# Altium project Drivers.PrjPcb
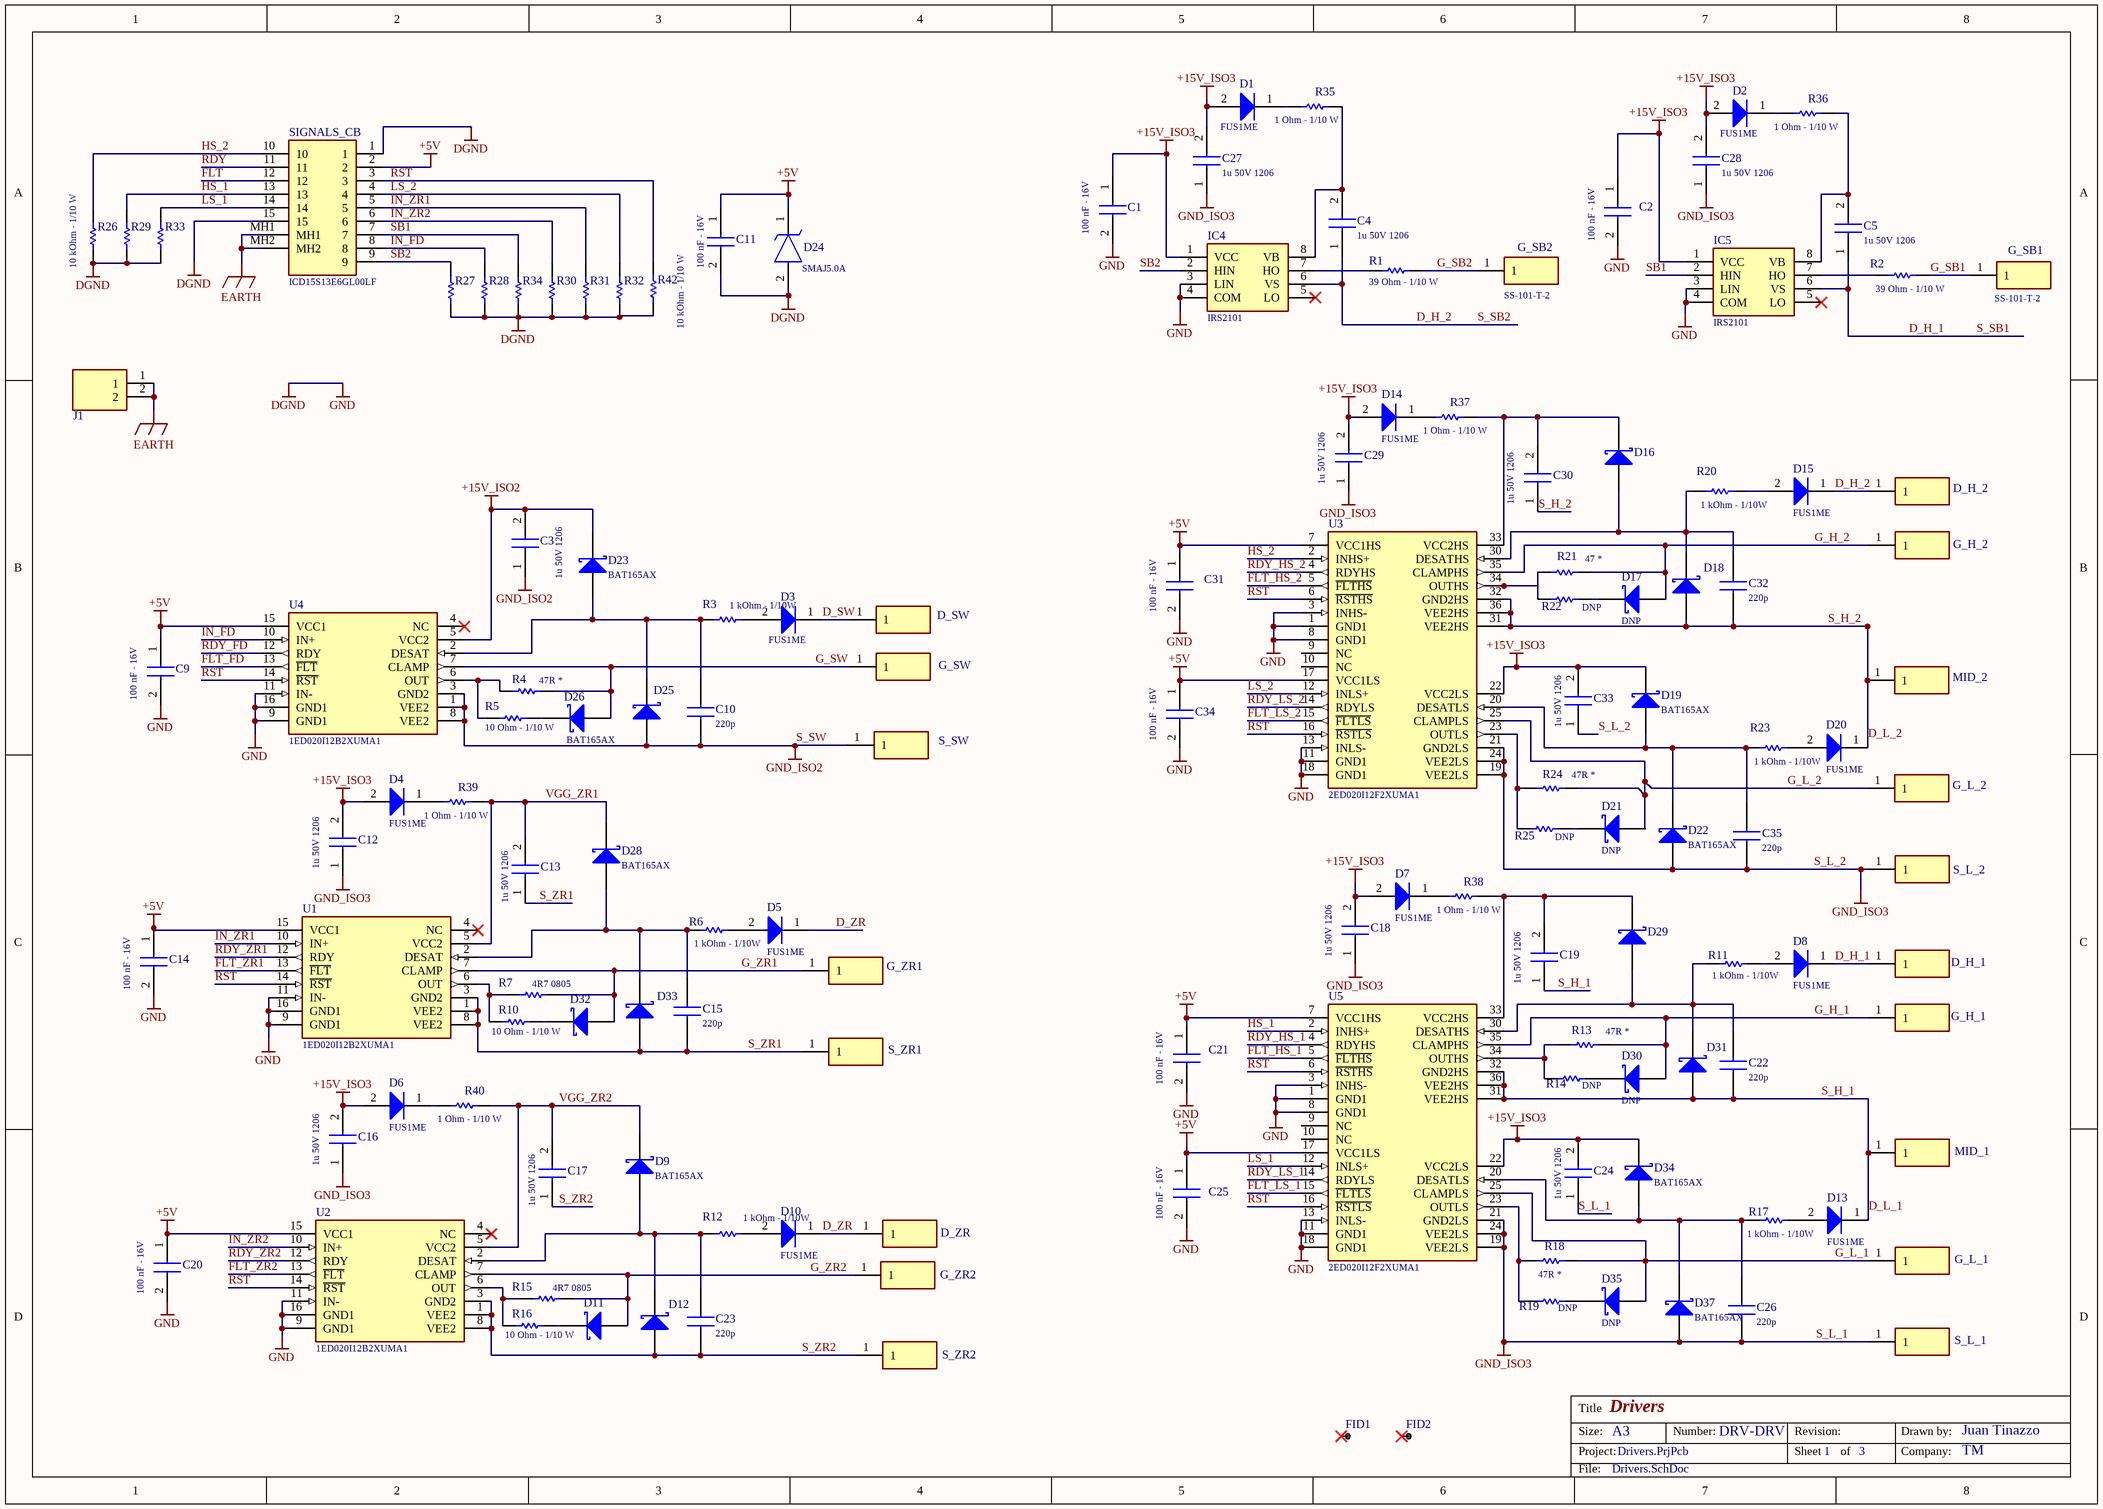
[diagram p0: Drivers.SchDoc]
REV: R8
3 sheets, 168 parts. Net scope: global (net labels, ports and power ports of the same name join across sheets).
Board file: Drivers.PcbDoc
Sheets:
  Drivers.SchDoc
  Gates.SchDoc
  Power.SchDoc

## Sheet Drivers.SchDoc: Drivers
size A3; SheetNumber: 1; SheetTotal: 3; DrawnBy: Juan Tinazzo; Organization: PAI; DocumentNumber: 1; Revision: R8; Number: DRV-DRV; Company: TM

### Parts
C1  value 100 nF - 16V  [CAPC1608X95N]  (hidden comment: 100n)
C2  value 100 nF - 16V  [CAPC1608X95N]  (hidden comment: 100n)
C3  1u 50V 1206  [CAPC3216X180N]
C4  1u 50V 1206  [CAPC3216X180N]
C5  1u 50V 1206  [CAPC3216X180N]
C9  value 100 nF - 16V  [CAPC1608X95N]  (hidden comment: 100n)
C10  220p  [C0603]
C11  value 100 nF - 16V  [CAPC1608X95N]  (hidden comment: 100n)
C12  1u 50V 1206  [CAPC3216X180N]
C13  1u 50V 1206  [CAPC3216X180N]
C14  value 100 nF - 16V  [CAPC1608X95N]  (hidden comment: 100n)
C15  220p  [C0603]
C16  1u 50V 1206  [CAPC3216X180N]
C17  1u 50V 1206  [CAPC3216X180N]
C18  1u 50V 1206  [CAPC3216X180N]
C19  1u 50V 1206  [CAPC3216X180N]
C20  value 100 nF - 16V  [CAPC1608X95N]  (hidden comment: 100n)
C21  value 100 nF - 16V  [CAPC1608X95N]  (hidden comment: 100n)
C22  220p  [C0603]
C23  220p  [C0603]
C24  1u 50V 1206  [CAPC3216X180N]
C25  value 100 nF - 16V  [CAPC1608X95N]  (hidden comment: 100n)
C26  220p  [C0603]
C27  1u 50V 1206  [CAPC3216X180N]
C28  1u 50V 1206  [CAPC3216X180N]
C29  1u 50V 1206  [CAPC3216X180N]
C30  1u 50V 1206  [CAPC3216X180N]
C31  value 100 nF - 16V  [CAPC1608X95N]  (hidden comment: 100n)
C32  220p  [C0603]
C33  1u 50V 1206  [CAPC3216X180N]
C34  value 100 nF - 16V  [CAPC1608X95N]  (hidden comment: 100n)
C35  220p  [C0603]
D1  FUS1ME  [SODFL3718X120N]
D2  FUS1ME  [SODFL3718X120N]
D3  FUS1ME  [SODFL3718X120N]
D4  FUS1ME  [SODFL3718X120N]
D5  FUS1ME  [SODFL3718X120N]
D6  FUS1ME  [SODFL3718X120N]
D7  FUS1ME  [SODFL3718X120N]
D8  FUS1ME  [SODFL3718X120N]
D9  BAT165AX  [BAT165AX]
D10  FUS1ME  [SODFL3718X120N]
D11  BAT165AX  [BAT165AX]  (value not drawn)
D12  BAT165AX  [BAT165AX]  (value not drawn)
D13  FUS1ME  [SODFL3718X120N]
D14  FUS1ME  [SODFL3718X120N]
D15  FUS1ME  [SODFL3718X120N]
D16  BAT165AX  [BAT165AX]  (value not drawn)
D17  DNP  [BAT165AX]
D18  BAT165AX  [BAT165AX]  (value not drawn)
D19  BAT165AX  [BAT165AX]
D20  FUS1ME  [SODFL3718X120N]
D21  DNP  [BAT165AX]
D22  BAT165AX  [BAT165AX]
D23  BAT165AX  [BAT165AX]
D24  SMAJ5.0A  [DIOM5026X229N]
D25  BAT165AX  [BAT165AX]  (value not drawn)
D26  BAT165AX  [BAT165AX]
D28  BAT165AX  [BAT165AX]
D29  BAT165AX  [BAT165AX]  (value not drawn)
D30  DNP  [BAT165AX]
D31  BAT165AX  [BAT165AX]  (value not drawn)
D32  BAT165AX  [BAT165AX]  (value not drawn)
D33  BAT165AX  [BAT165AX]  (value not drawn)
D34  BAT165AX  [BAT165AX]
D35  DNP  [BAT165AX]
D37  BAT165AX  [BAT165AX]
D_H_1  SS-101-T-2  [SS-101-XX-2]  (value not drawn)
D_H_2  SS-101-T-2  [SS-101-XX-2]  (value not drawn)
D_SW  D_SW  [SS-101-XX-2]  (value not drawn)
D_ZR  SS-101-T-2  [SS-101-XX-2]  (value not drawn)
FID1  Fiducial  [Fiducial]  (value not drawn)  (no BOM)
FID2  Fiducial  [Fiducial]  (value not drawn)  (no BOM)
G_H_1  SS-101-T-2  [SS-101-XX-2]  (value not drawn)
G_H_2  SS-101-T-2  [SS-101-XX-2]  (value not drawn)
G_L_1  SS-101-T-2  [SS-101-XX-2]  (value not drawn)
G_L_2  SS-101-T-2  [SS-101-XX-2]  (value not drawn)
G_SB1  SS-101-T-2  [SS-101-XX-2]
G_SB2  SS-101-T-2  [SS-101-XX-2]
G_SW  G_SW  [SS-101-XX-2]  (value not drawn)
G_ZR1  SS-101-T-2  [SS-101-XX-2]  (value not drawn)
G_ZR2  SS-101-T-2  [SS-101-XX-2]  (value not drawn)
IC4  IRS2101  [SOIC127P600X175-8N]
IC5  IRS2101  [SOIC127P600X175-8N]
J1  19705-4303  [197054303]  (value not drawn)
MID_1  SS-101-T-2  [SS-101-XX-2]  (value not drawn)
MID_2  SS-101-T-2  [SS-101-XX-2]  (value not drawn)
R1  value 39 Ohm - 1/10 W  [RESC1608X55N]  (hidden comment: CRCW0603150RFKEBC)
R2  value 39 Ohm - 1/10 W  [RESC1608X55N]  (hidden comment: CRCW0603150RFKEBC)
R3  value 1 kOhm - 1/10W  [RESC1608X55N]  (hidden comment: CRCW06031K00FKEAC)
R4  47R *  [RESC2012X60N]
R5  value 10 Ohm - 1/10 W  [RESC1608X50N]  (hidden comment: CRCW060310R0FKEAHP)
R6  value 1 kOhm - 1/10W  [RESC1608X55N]  (hidden comment: CRCW06031K00FKEAC)
R7  4R7 0805  [RESC2012X60N]
R10  value 10 Ohm - 1/10 W  [RESC1608X50N]  (hidden comment: CRCW060310R0FKEAHP)
R11  value 1 kOhm - 1/10W  [RESC1608X55N]  (hidden comment: CRCW06031K00FKEAC)
R12  value 1 kOhm - 1/10W  [RESC1608X55N]  (hidden comment: CRCW06031K00FKEAC)
R13  47R *  [RESC2012X60N]
R14  value DNP  [RESC1608X50N]  (hidden comment: CRCW060310R0FKEAHP)
R15  4R7 0805  [RESC2012X60N]
R16  value 10 Ohm - 1/10 W  [RESC1608X50N]  (hidden comment: CRCW060310R0FKEAHP)
R17  value 1 kOhm - 1/10W  [RESC1608X55N]  (hidden comment: CRCW06031K00FKEAC)
R18  47R *  [RESC2012X60N]
R19  value DNP  [RESC1608X50N]  (hidden comment: CRCW060310R0FKEAHP)
R20  value 1 kOhm - 1/10W  [RESC1608X55N]  (hidden comment: CRCW06031K00FKEAC)
R21  47 *  [RESC2012X60N]
R22  value DNP  [RESC1608X50N]  (hidden comment: CRCW060310R0FKEAHP)
R23  value 1 kOhm - 1/10W  [RESC1608X55N]  (hidden comment: CRCW06031K00FKEAC)
R24  47R *  [RESC2012X60N]
R25  value DNP  [RESC1608X50N]  (hidden comment: CRCW060310R0FKEAHP)
R26  value 10 kOhm - 1/10 W  [RESC1608X55N]  (hidden comment: RMC1_16K1002FTP)
R27  RMC1_16K1002FTP  [RESC1608X55N]  (value not drawn)
R28  RMC1_16K1002FTP  [RESC1608X55N]  (value not drawn)
R29  RMC1_16K1002FTP  [RESC1608X55N]  (value not drawn)
R30  RMC1_16K1002FTP  [RESC1608X55N]  (value not drawn)
R31  RMC1_16K1002FTP  [RESC1608X55N]  (value not drawn)
R32  RMC1_16K1002FTP  [RESC1608X55N]  (value not drawn)
R33  RMC1_16K1002FTP  [RESC1608X55N]  (value not drawn)
R34  RMC1_16K1002FTP  [RESC1608X55N]  (value not drawn)
R35  value 1 Ohm - 1/10 W  [RESC1608X55N]  (hidden comment: 1R)
R36  value 1 Ohm - 1/10 W  [RESC1608X55N]  (hidden comment: 1R)
R37  value 1 Ohm - 1/10 W  [RESC1608X55N]  (hidden comment: 1R)
R38  value 1 Ohm - 1/10 W  [RESC1608X55N]  (hidden comment: 1R)
R39  value 1 Ohm - 1/10 W  [RESC1608X55N]  (hidden comment: 1R)
R40  value 1 Ohm - 1/10 W  [RESC1608X55N]  (hidden comment: 1R)
R42  value 10 kOhm - 1/10 W  [RESC1608X55N]  (hidden comment: RMC1_16K1002FTP)
S_L_1  SS-101-T-2  [SS-101-XX-2]  (value not drawn)
S_L_2  SS-101-T-2  [SS-101-XX-2]  (value not drawn)
S_SW  S_SW  [SS-101-XX-2]  (value not drawn)
S_ZR1  SS-101-T-2  [SS-101-XX-2]  (value not drawn)
S_ZR2  SS-101-T-2  [SS-101-XX-2]  (value not drawn)
SIGNALS_CB  ICD15S13E6GL00LF  [ICD15S13E6GL00LF]
U1  1ED020I12B2XUMA1  [SOIC127P1028X264-16N]
U2  1ED020I12B2XUMA1  [SOIC127P1028X264-16N]
U3  2ED020I12F2XUMA1  [2ED020I12F2XUMA1]
U4  1ED020I12B2XUMA1  [SOIC127P1028X264-16N]
U5  2ED020I12F2XUMA1  [2ED020I12F2XUMA1]

### Nets
+5V: C9.1 C11.1 C14.1 C20.1 C21.1 C25.1 C31.1 C34.1 D24.1(K) SIGNALS_CB.2 U1.15(VCC1) U2.15(VCC1) U3.7(VCC1HS) U3.17(VCC1LS) U4.15(VCC1) U5.7(VCC1HS) U5.17(VCC1LS)
+15V_ISO2: C3.2 D23.1(K) U4.5(VCC2)
+15V_ISO3: C1.1 C2.1 C12.2 C16.2 C18.2 C24.2 C27.2 C28.2 C29.2 C33.2 D1.2(A) D2.2(A) D4.2(A) D6.2(A) D7.2(A) D14.2(A) D19.1(K) D34.1(K) IC4.1(VCC) IC5.1(VCC) U3.22(VCC2LS) U5.22(VCC2LS)
DGND: C1.2 C2.2 C9.2 C11.2 C14.2 C20.2 C21.2 C25.2 C31.2 C34.2 D24.2(A) IC4.3(LIN) IC4.4(COM) IC5.3(LIN) IC5.4(COM) R26.1 R27.1 R28.1 R29.1 R30.1 R31.1 R32.1 R33.1 R34.1 R42.1 SIGNALS_CB.1 SIGNALS_CB.15 U1.9(GND1) U1.11(IN-) U1.16(GND1) U2.9(GND1) U2.11(IN-) U2.16(GND1) U3.1(GND1) U3.3(INHS-) U3.8(GND1) U3.11(GND1) U3.13(INLS-) U3.18(GND1) U4.9(GND1) U4.11(IN-) U4.16(GND1) U5.1(GND1) U5.3(INHS-) U5.8(GND1) U5.11(GND1) U5.13(INLS-) U5.18(GND1)  [also labelled GND]
EARTH: J1.1 J1.2 SIGNALS_CB.MH1 SIGNALS_CB.MH2
GND_ISO2: C3.1 C10.1 D25.2(A) S_SW.1 U4.1(VEE2) U4.3(GND2) U4.8(VEE2)  [also labelled S_SW]
GND_ISO3: C12.1 C16.1 C18.1 C24.1 C26.1 C27.1 C28.1 C29.1 C33.1 C35.1 D22.2(A) D37.2(A) S_L_1.1 S_L_2.1 U3.19(VEE2LS) U3.21(GND2LS) U3.24(VEE2LS) U5.19(VEE2LS) U5.21(GND2LS) U5.24(VEE2LS)  [also labelled S_L_1, S_L_2]
D_H_1: C5.1 D8.1(K) D_H_1.1 IC5.6(VS)  [also labelled S_SB1]
D_H_2: C4.1 D15.1(K) D_H_2.1 IC4.6(VS)  [also labelled S_SB2]
D_L_1: C19.1 C22.1 D13.1(K) D31.2(A) MID_1.1 U5.31(VEE2HS) U5.32(GND2HS) U5.36(VEE2HS)  [also labelled S_H_1]
D_L_2: C30.1 C32.1 D18.2(A) D20.1(K) MID_2.1 U3.31(VEE2HS) U3.32(GND2HS) U3.36(VEE2HS)  [also labelled S_H_2]
D_SW: D3.1(K) D_SW.1
D_ZR: D5.1(K) D10.1(K) D_ZR.1
FLT: SIGNALS_CB.12
FLT_FD: U4.13(~{FLT})
FLT_HS_1: U5.5(~{FLTHS})
FLT_HS_2: U3.5(~{FLTHS})
FLT_LS_1: U5.15(~{FLTLS})
FLT_LS_2: U3.15(~{FLTLS})
FLT_ZR1: U1.13(~{FLT})
FLT_ZR2: U2.13(~{FLT})
G_H_1: D30.2(A) G_H_1.1 R13.2 U5.35(CLAMPHS)
G_H_2: D17.2(A) G_H_2.1 R21.2 U3.35(CLAMPHS)
G_L_1: D35.2(A) G_L_1.1 R18.2 U5.25(CLAMPLS)
G_L_2: D21.2(A) G_L_2.1 R24.2 U3.25(CLAMPLS)
G_SB1: G_SB1.1 R2.2
G_SB2: G_SB2.1 R1.2
G_SW: D26.2(A) G_SW.1 R4.2 U4.7(CLAMP)
G_ZR1: D32.2(A) G_ZR1.1 R7.2 U1.7(CLAMP)
G_ZR2: D11.2(A) G_ZR2.1 R15.2 U2.7(CLAMP)
HS_1: R29.2 SIGNALS_CB.13 U5.2(INHS+)
HS_2: R26.2 SIGNALS_CB.10 U3.2(INHS+)
IN_FD: R28.2 SIGNALS_CB.8 U4.10(IN+)
IN_ZR1: R31.2 SIGNALS_CB.5 U1.10(IN+)
IN_ZR2: R30.2 SIGNALS_CB.6 U2.10(IN+)
LS_1: R33.2 SIGNALS_CB.14 U5.12(INLS+)
LS_2: R32.2 SIGNALS_CB.4 U3.12(INLS+)
RDY: SIGNALS_CB.11
RDY_FD: U4.12(RDY)
RDY_HS_1: U5.4(RDYHS)
RDY_HS_2: U3.4(RDYHS)
RDY_LS_1: U5.14(RDYLS)
RDY_LS_2: U3.14(RDYLS)
RDY_ZR1: U1.12(RDY)
RDY_ZR2: U2.12(RDY)
RST: R42.2 SIGNALS_CB.3 U1.14(~{RST}) U2.14(~{RST}) U3.6(~{RSTHS}) U3.16(~{RSTLS}) U4.14(~{RST}) U5.6(~{RSTHS}) U5.16(~{RSTLS})
S_ZR1: C13.1 C15.1 D33.2(A) S_ZR1.1 U1.1(VEE2) U1.3(GND2) U1.8(VEE2)
S_ZR2: C17.1 C23.1 D12.2(A) S_ZR2.1 U2.1(VEE2) U2.3(GND2) U2.8(VEE2)
SB1: IC5.2(HIN) R34.2 SIGNALS_CB.7
SB2: IC4.2(HIN) R27.2 SIGNALS_CB.9
VGG_ZR1: C13.2 D28.1(K) R39.2 U1.5(VCC2)
VGG_ZR2: C17.2 D9.1(K) R40.2 U2.5(VCC2)
NetC4_2: C4.2 IC4.8(VB) R35.2
NetC5_2: C5.2 IC5.8(VB) R36.2
NetC10_2: C10.2 D23.2(A) D25.1(K) R3.1 U4.2(DESAT)
NetC15_2: C15.2 D28.2(A) D33.1(K) R6.1 U1.2(DESAT)
NetC19_2: C19.2 D29.1(K) R38.2 U5.33(VCC2HS)
NetC22_2: C22.2 D29.2(A) D31.1(K) R11.1 U5.30(DESATHS)
NetC23_2: C23.2 D9.2(A) D12.1(K) R12.1 U2.2(DESAT)
NetC26_2: C26.2 D34.2(A) D37.1(K) R17.1 U5.20(DESATLS)
NetC30_2: C30.2 D16.1(K) R37.2 U3.33(VCC2HS)
NetC32_2: C32.2 D16.2(A) D18.1(K) R20.1 U3.30(DESATHS)
NetC35_2: C35.2 D19.2(A) D22.1(K) R23.1 U3.20(DESATLS)
NetD1_1: D1.1(K) R35.1
NetD2_1: D2.1(K) R36.1
NetD3_2: D3.2(A) R3.2
NetD4_1: D4.1(K) R39.1
NetD5_2: D5.2(A) R6.2
NetD6_1: D6.1(K) R40.1
NetD7_1: D7.1(K) R38.1
NetD8_2: D8.2(A) R11.2
NetD10_2: D10.2(A) R12.2
NetD11_1: D11.1(K) R16.2
NetD13_2: D13.2(A) R17.2
NetD14_1: D14.1(K) R37.1
NetD15_2: D15.2(A) R20.2
NetD17_1: D17.1(K) R22.2
NetD20_2: D20.2(A) R23.2
NetD21_1: D21.1(K) R25.2
NetD26_1: D26.1(K) R5.2
NetD30_1: D30.1(K) R14.2
NetD32_1: D32.1(K) R10.2
NetD35_1: D35.1(K) R19.2
NetIC4_7: IC4.7(HO) R1.1
NetIC5_7: IC5.7(HO) R2.1
NetR4_1: R4.1 R5.1 U4.6(OUT)
NetR7_1: R7.1 R10.1 U1.6(OUT)
NetR13_1: R13.1 R14.1 U5.34(OUTHS)
NetR15_1: R15.1 R16.1 U2.6(OUT)
NetR18_1: R18.1 R19.1 U5.23(OUTLS)
NetR21_1: R21.1 R22.1 U3.34(OUTHS)
NetR24_1: R24.1 R25.1 U3.23(OUTLS)

Not connected (* = marked no-connect by the designer): FID1 1*; FID2 1*; IC4 5(LO)*; IC5 5(LO)*; U1 4(NC)*; U2 4(NC)*; U3 9(NC) 10(NC); U4 4(NC)*; U5 9(NC) 10(NC)

### Notes on the sheet
- Title
- Size:
- Project:
- A3
- Number:
- Revision:
- Sheet
- of
- Drawn by:
- Company:
- File:

### Library data of the parts
C1 C2 C9 C11 C14 C20 C21 C25 C31 C34 = EMK107B7104KA-T: Capacitor; Manufacturer_Name: TAIYO YUDEN; Datasheet Link: http://www.farnell.com/datasheets/746258.pdf; Height: 0.95mm; Manufacturer_Part_Number: EMK107B7104KA-T; Mouser Part Number: 963-EMK107B7104KA-T; Mouser Price/Stock: https://www.mouser.co.uk/ProductDetail/Taiyo-Yuden/EMK107B7104KA-T?qs=I6KAKw0tg2ybqzX8hKPgfw%3D%3D; Arrow Part Number: EMK107B7104KA-T; Arrow Price/Stock: https://www.arrow.com/en/products/emk107b7104ka-t/taiyo-yuden
C3-C5 C12 C13 C16-C19 C24 C27-C30 C33 = C3216X7R1H105K160AE: Capacitor; Manufacturer_Name: TDK; Value: 1 uF - 50V; Datasheet Link: https://product.tdk.com/info/en/catalog/datasheets/mlcc_commercial_midvoltage_en.pdf; Height: 1.8mm; Manufacturer_Part_Number: C3216X7R1H105K160AE; Mouser Part Number: 810-C3216X7R1H105KST; Mouser Price/Stock: https://www.mouser.co.uk/ProductDetail/TDK/C3216X7R1H105K160AE?qs=LcTL%2F5vFEzHWgMW0Em18fQ%3D%3D; Arrow Part Number: C3216X7R1H105K160AE; Arrow Price/Stock: https://www.arrow.com/en/products/c3216x7r1h105k160ae/tdk?region=nac
C10 C15 C22 C23 C26 C32 C35 = C0603C221J5HACAUTO: Capacitor; Manufacturer_Name: KEMET; Value: 220 pF - 50V; Datasheet Link: https://content.kemet.com/datasheets/KEM_C1007_X8R_ULTRA_150C_SMD.pdf; Height: 0.87mm; Manufacturer_Part_Number: C0603C221J5HACAUTO; Mouser Part Number: 80-C0603C221J5HAUTO; Mouser Price/Stock: https://www.mouser.co.uk/ProductDetail/KEMET/C0603C221J5HACAUTO?qs=j%252B1pi9TdxUZayjzZ3rh80g%3D%3D
D1-D8 D10 D13-D15 D20 = FUS1ME: Diode; Manufacturer_Name: Diodes Incorporated; Value: 1A - 1kV; Datasheet Link: https://www.diodes.com/assets/Datasheets/FUS1ME.pdf; Height: 1.2mm; Manufacturer_Part_Number: FUS1ME; Mouser Part Number: 621-FUS1ME; Mouser Price/Stock: https://www.mouser.co.uk/ProductDetail/Diodes-Incorporated/FUS1ME?qs=Znm5pLBrcAI2lQqtoxHPBQ%3D%3D
D9 D11 D12 D16-D19 D21-D23 D25 D26 D28-D35 D37 = BAT165AX: Schottky Diode; Manufacturer_Name: Nexperia; Value: 750 mA - 40V; Datasheet Link: https://assets.nexperia.com/documents/data-sheet/BAT165A.pdf; Height: 1.1mm; Manufacturer_Part_Number: BAT165AX; Mouser Part Number: 771-BAT165AX; Mouser Price/Stock: https://www.mouser.co.uk/ProductDetail/Nexperia/BAT165AX?qs=1fQ7IOp4WriMQ9TlJoQ5jw%3D%3D; Arrow Part Number: BAT165AX; Arrow Price/Stock: https://www.arrow.com/en/products/bat165ax/nexperia?region=nac
D24 = SMAJ5.0A: TVS Diode (Uni-directional); Manufacturer_Name: LITTELFUSE; Value: 1CH - Unidireccional - 5V - 3.3 W; Datasheet Link: https://www.littelfuse.com/~/media/electronics/datasheets/tvs_diodes/littelfuse_tvs_diode_smaj_datasheet.pdf.pdf; Height: 2.29mm; Manufacturer_Part_Number: SMAJ5.0A; Mouser Part Number: 576-SMAJ5.0A; Mouser Price/Stock: https://www.mouser.co.uk/ProductDetail/Littelfuse/SMAJ5.0A?qs=2VFNtWizgicfetZVA4gWHA%3D%3D; Arrow Part Number: SMAJ5.0A; Arrow Price/Stock: https://www.arrow.com/en/products/smaj5.0a/littelfuse?region=europe
D_H_1 D_H_2 D_SW D_ZR G_H_1 G_H_2 G_L_1 G_L_2 G_SB1 G_SB2 G_SW G_ZR1 G_ZR2 MID_1 MID_2 S_L_1 S_L_2 S_SW S_ZR1 S_ZR2 = SS-101-T-2: Connector; Manufacturer_Name: SAMTEC; Value: Sockets 2.54mm (0.1 In); Mouser Part Number: 200-SS101T2; Datasheet Link: http://suddendocs.samtec.com/prints/sx-1xx-xx-xx-x-x-mkt.pdf; Manufacturer_Part_Number: SS-101-T-2; Mouser Price/Stock: https://www.mouser.co.uk/ProductDetail/Samtec/SS-101-T-2?qs=rU5fayqh%252BE1oUmnQsbG0BA%3D%3D; Arrow Part Number: SS-101-T-2; Arrow Price/Stock: https://www.arrow.com/en/products/ss-101-t-2/samtec; System: Connector
IC4 IC5 = IRS2101STRPBF: Integrated Circuit; Manufacturer_Name: Infineon; Value: Controladores de puertas Hi&Lw Sd Drvr; Datasheet Link: https://www.infineon.com/cms/en/product/power/gate-driver-ics/?; Height: 1.75mm; Manufacturer_Part_Number: IRS2101STRPBF; Mouser Part Number: 942-IRS2101STRPBF; Mouser Price/Stock: https://www.mouser.co.uk/ProductDetail/Infineon-Technologies/IRS2101STRPBF?qs=9%252BKlkBgLFf0%252B%252BiaV%252Bo1POw%3D%3D; Arrow Part Number: IRS2101STRPBF; Arrow Price/Stock: https://www.arrow.com/en/products/irs2101strpbf/infineon-technologies-ag?region=nac
J1 = 19705-4303: Connector; Manufacturer_Name: Molex; Value: Terminales QUICK DISCONNECT TAB; Datasheet Link: https://www.molex.com/pdm_docs/sd/197054303_sd.pdf; Height: 10.29mm; Manufacturer_Part_Number: 19705-4303
R1 R2 = CRCW0603150RFKEBC: Resistor; Manufacturer_Name: Vishay; Datasheet Link: https://www.arrow.com/en/products/crcw0603150rfkebc/vishay?region=nac; Height: 0.55mm; Manufacturer_Part_Number: CRCW0603150RFKEBC; Mouser Part Number: 71-CRCW0603150RFKEBC; Mouser Price/Stock: https://www.mouser.co.uk/ProductDetail/Vishay-Dale/CRCW0603150RFKEBC?qs=wd5RIQLrsJhKPm2KOKYOfA%3D%3D; Arrow Part Number: CRCW0603150RFKEBC; Arrow Price/Stock: https://www.arrow.com/en/products/crcw0603150rfkebc/vishay?region=nac
R3 R6 R11 R12 R17 R20 R23 = CRCW06031K00FKEAC: Resistor; Manufacturer_Name: Vishay; Datasheet Link: https://www.vishay.com/docs/28773/crcwce3.pdf; Height: 0.55mm; Manufacturer_Part_Number: CRCW06031K00FKEAC; Mouser Part Number: 71-CRCW06031K00FKEAC; Mouser Price/Stock: https://www.mouser.co.uk/ProductDetail/Vishay-Dale/CRCW06031K00FKEAC?qs=E3Y5ESvWgWOQ7ePIWbGVFg%3D%3D; Arrow Part Number: CRCW06031K00FKEAC; Arrow Price/Stock: https://www.arrow.com/en/products/crcw06031k00fkeac/vishay?region=nac
R4 R7 R13 R15 R18 R21 R24 = CR0805-J_-4R7ELF: Resistor; Manufacturer_Name: Bourns; Manufacturer_Part_Number: CR0805-J/-4R7ELF; Value: 4.7 Ohm - 1/8W; Datasheet Link: https://www.bourns.com/pdfs/chpreztr.pdf; Height: 0.6mm; Mouser Part Number: 652-CR0805-J/-4R7ELF; Mouser Price/Stock: https://www.mouser.co.uk/ProductDetail/Bourns/CR0805-J-4R7ELF?qs=wL7NMIHXUPnU6BnKcjMBug%3D%3D
R5 R10 R14 R16 R19 R22 R25 = CRCW060310R0FKEAHP: Resistor; Manufacturer_Name: Vishay; Datasheet Link: http://www.farnell.com/datasheets/1885357.pdf; Height: 0.5mm; Manufacturer_Part_Number: CRCW060310R0FKEAHP; Mouser Part Number: 71-CRCW060310R0FKEAH; Mouser Price/Stock: https://www.mouser.co.uk/ProductDetail/Vishay-Dale/CRCW060310R0FKEAHP?qs=k2%2FDWSARqgHKJ7AdmQKyZw%3D%3D; Arrow Part Number: CRCW060310R0FKEAHP; Arrow Price/Stock: https://www.arrow.com/en/products/crcw060310r0fkeahp/vishay?region=nac
R26 R42 = RMC1_16K1002FTP: Resistor; Manufacturer_Name: Kamaya; Manufacturer_Part_Number: RMC1/16K1002FTP; Datasheet Link: https://componentsearchengine.com/Datasheets/1/RMC1_16K1002FTP.pdf; Height: 0.55mm
R27-R34 = RMC1_16K1002FTP: Resistor; Manufacturer_Name: Kamaya; Manufacturer_Part_Number: RMC1/16K1002FTP; Value: 10 kOhm - 1/10 W; Datasheet Link: https://componentsearchengine.com/Datasheets/1/RMC1_16K1002FTP.pdf; Height: 0.55mm
R35-R40 = CR0603-F_-1R00ELF: Resistor; Manufacturer_Name: Bourns; Manufacturer_Part_Number: CR0603-F/-1R00ELF; Datasheet Link: https://www.bourns.com/pdfs/chpreztr.pdf; Height: 0.55mm; Mouser Part Number: 652-CR0603-F/1R00ELF; Mouser Price/Stock: https://www.mouser.co.uk/ProductDetail/Bourns/CR0603-F-1R00ELF?qs=W%2FMpXkg%252BdQ7nBNmKZ%2F9sTA%3D%3D
SIGNALS_CB = ICD15S13E6GL00LF: Connector; Manufacturer_Name: Amphenol Communications Solutions; Value: Conectores de alta densidad subminiatura D HD 15P; Datasheet Link: https://cdn.amphenol-cs.com/media/wysiwyg/files/drawing/c-cd-0012.pdf; Height: 12.96mm; Manufacturer_Part_Number: ICD15S13E6GL00LF; System: Connector
U1 U2 U4 = 1ED020I12B2XUMA1: Integrated Circuit; Manufacturer_Name: Infineon; Value: Controladores de puertas 1200V Isolated 1-CH, 2A; Datasheet Link: https://www.infineon.com/dgdl/Infineon-1ED020I12_B2-DS-v02_00-en.pdf?fileId=db3a304333227b5e013344bf16f84ca6; Height: 2.64mm; Manufacturer_Part_Number: 1ED020I12B2XUMA1; Mouser Part Number: 726-1ED020I12B2XUMA1; Mouser Price/Stock: https://www.mouser.co.uk/ProductDetail/Infineon-Technologies/1ED020I12B2XUMA1?qs=LxJ0xX%2FWJR5n74YhjSZS4A%3D%3D; Arrow Part Number: 1ED020I12B2XUMA1; Arrow Price/Stock: https://www.arrow.com/en/products/1ed020i12b2xuma1/infineon-technologies-ag?region=nac
U3 U5 = 2ED020I12F2XUMA1: Integrated Circuit; Manufacturer_Name: Infineon; Value: Controladores de puertas 1200V Isolated 2-CH; Datasheet Link: https://www.infineon.com/cms/en/product/power/gate-driver-ics/?; Height: 2.65mm; Manufacturer_Part_Number: 2ED020I12F2XUMA1; Mouser Part Number: 726-2ED020I12F2XUMA1; Mouser Price/Stock: https://www.mouser.co.uk/ProductDetail/Infineon-Technologies/2ED020I12F2XUMA1?qs=LxJ0xX%2FWJR6J8smgvJGfuA%3D%3D; Arrow Part Number: 2ED020I12F2XUMA1; Arrow Price/Stock: https://www.arrow.com/en/products/2ed020i12f2xuma1/infineon-technologies-ag?region=nac

## Sheet Gates.SchDoc: Gates
size A4; CompanyName: TM; DrawnBy: Juan Tinazzo; DocumentNumber: 2; Revision: R8; SheetNumber: 2; SheetTotal: 3; Number: DRV-GTS
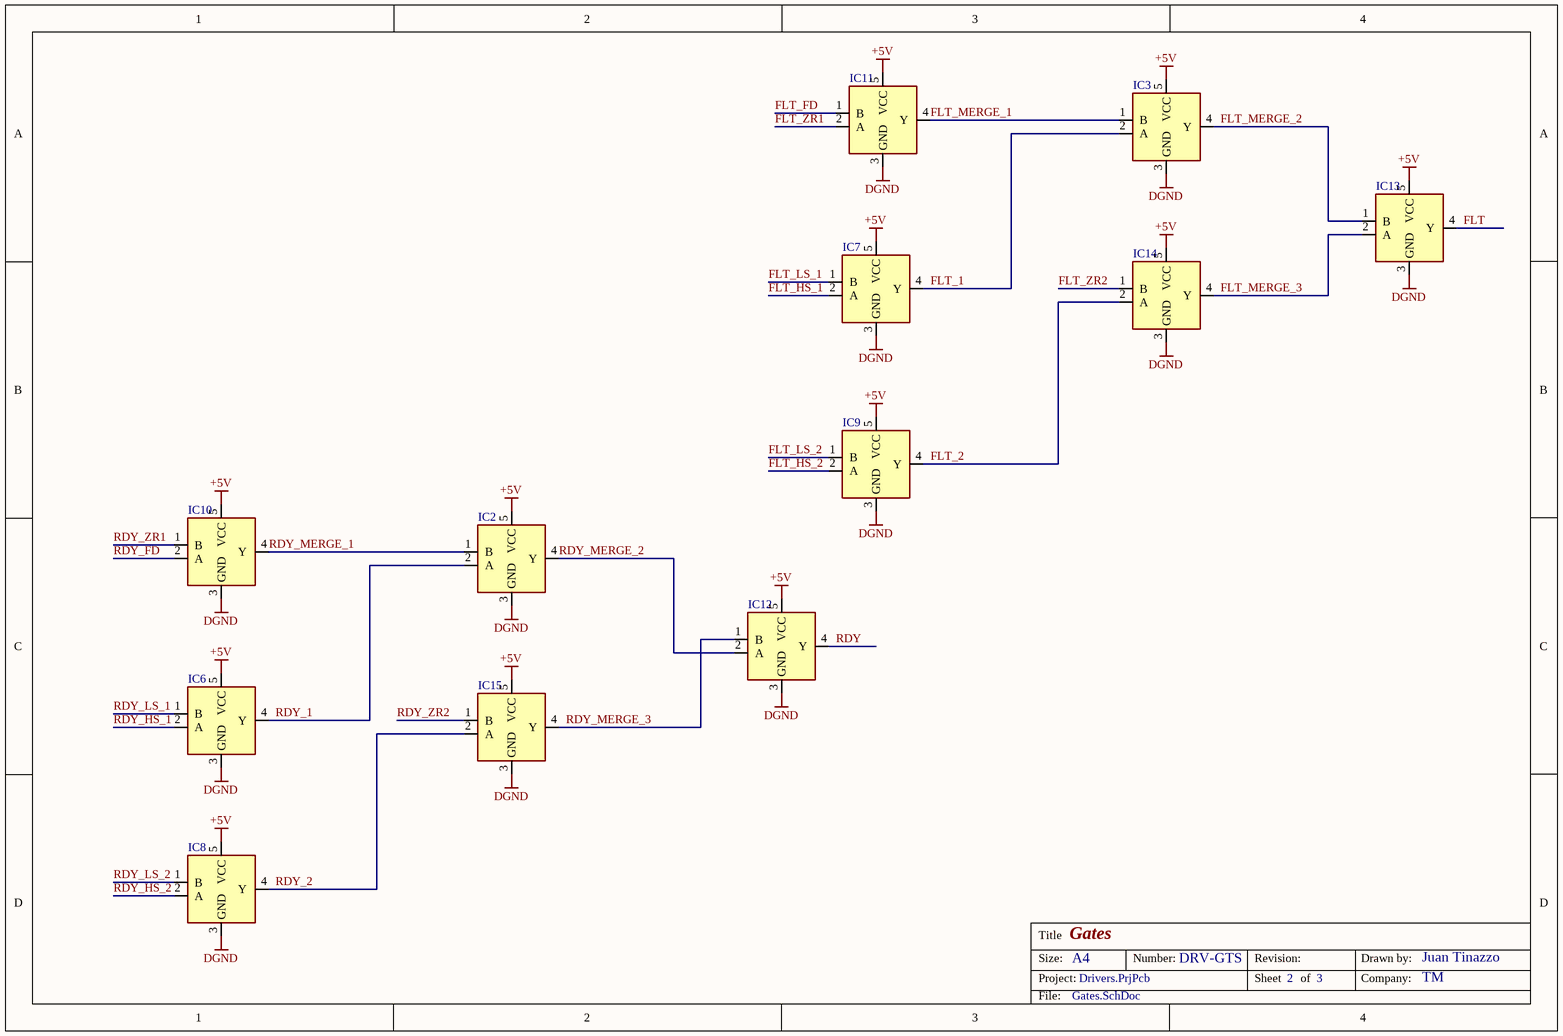
[diagram p1: Gates.SchDoc]

### Parts
IC2  74LVC1G08GW,125  [SOT65P210X110-5N]  (value not drawn)
IC3  74LVC1G08GW,125  [SOT65P210X110-5N]  (value not drawn)
IC6  74LVC1G08GW,125  [SOT65P210X110-5N]  (value not drawn)
IC7  74LVC1G08GW,125  [SOT65P210X110-5N]  (value not drawn)
IC8  74LVC1G08GW,125  [SOT65P210X110-5N]  (value not drawn)
IC9  74LVC1G08GW,125  [SOT65P210X110-5N]  (value not drawn)
IC10  74LVC1G08GW,125  [SOT65P210X110-5N]  (value not drawn)
IC11  74LVC1G08GW,125  [SOT65P210X110-5N]  (value not drawn)
IC12  74LVC1G08GW,125  [SOT65P210X110-5N]  (value not drawn)
IC13  74LVC1G08GW,125  [SOT65P210X110-5N]  (value not drawn)
IC14  74LVC1G08GW,125  [SOT65P210X110-5N]  (value not drawn)
IC15  74LVC1G08GW,125  [SOT65P210X110-5N]  (value not drawn)

### Nets
+5V: IC2.5(VCC) IC3.5(VCC) IC6.5(VCC) IC7.5(VCC) IC8.5(VCC) IC9.5(VCC) IC10.5(VCC) IC11.5(VCC) IC12.5(VCC) IC13.5(VCC) IC14.5(VCC) IC15.5(VCC)
DGND: IC2.3(GND) IC3.3(GND) IC6.3(GND) IC7.3(GND) IC8.3(GND) IC9.3(GND) IC10.3(GND) IC11.3(GND) IC12.3(GND) IC13.3(GND) IC14.3(GND) IC15.3(GND)
FLT: IC13.4(Y)
FLT_1: IC3.2(A) IC7.4(Y)
FLT_2: IC9.4(Y) IC14.2(A)
FLT_FD: IC11.1(B)
FLT_HS_1: IC7.2(A)
FLT_HS_2: IC9.2(A)
FLT_LS_1: IC7.1(B)
FLT_LS_2: IC9.1(B)
FLT_MERGE_1: IC3.1(B) IC11.4(Y)
FLT_MERGE_2: IC3.4(Y) IC13.1(B)
FLT_MERGE_3: IC13.2(A) IC14.4(Y)
FLT_ZR1: IC11.2(A)
FLT_ZR2: IC14.1(B)
RDY: IC12.4(Y)
RDY_1: IC2.2(A) IC6.4(Y)
RDY_2: IC8.4(Y) IC15.2(A)
RDY_FD: IC10.2(A)
RDY_HS_1: IC6.2(A)
RDY_HS_2: IC8.2(A)
RDY_LS_1: IC6.1(B)
RDY_LS_2: IC8.1(B)
RDY_MERGE_1: IC2.1(B) IC10.4(Y)
RDY_MERGE_2: IC2.4(Y) IC12.2(A)
RDY_MERGE_3: IC12.1(B) IC15.4(Y)
RDY_ZR1: IC10.1(B)
RDY_ZR2: IC15.1(B)

### Notes on the sheet
- Title
- Size:
- Project:
- A4
- Number:
- Revision:
- Sheet
- of
- Drawn by:
- Company:
- File:

### Library data of the parts
IC2 IC3 IC6-IC15 = 74LVC1G08GW,125: Integrated Circuit; Manufacturer_Name: Nexperia; Value: Compuertas AND - 1 compuerta 2 entradas; Datasheet Link: https://assets.nexperia.com/documents/data-sheet/74LVC1G08.pdf; Height: 1.1mm; Manufacturer_Part_Number: 74LVC1G08GW,125; Mouser Part Number: 771-74LVC1G08GW-G; Mouser Price/Stock: https://www.mouser.co.uk/ProductDetail/Nexperia/74LVC1G08GW125?qs=me8TqzrmIYVtW9TtT8QUhw%3D%3D; Arrow Part Number: 74LVC1G08GW,125; Arrow Price/Stock: https://www.arrow.com/en/products/74lvc1g08gw125/nexperia?region=nac

## Sheet Power.SchDoc: Power
size A4; CompanyName: TM; DrawnBy: Juan Tinazzo; DocumentNumber: 3; Revision: R8; SheetNumber: 3; SheetTotal: 3; Number: DRV-PWR
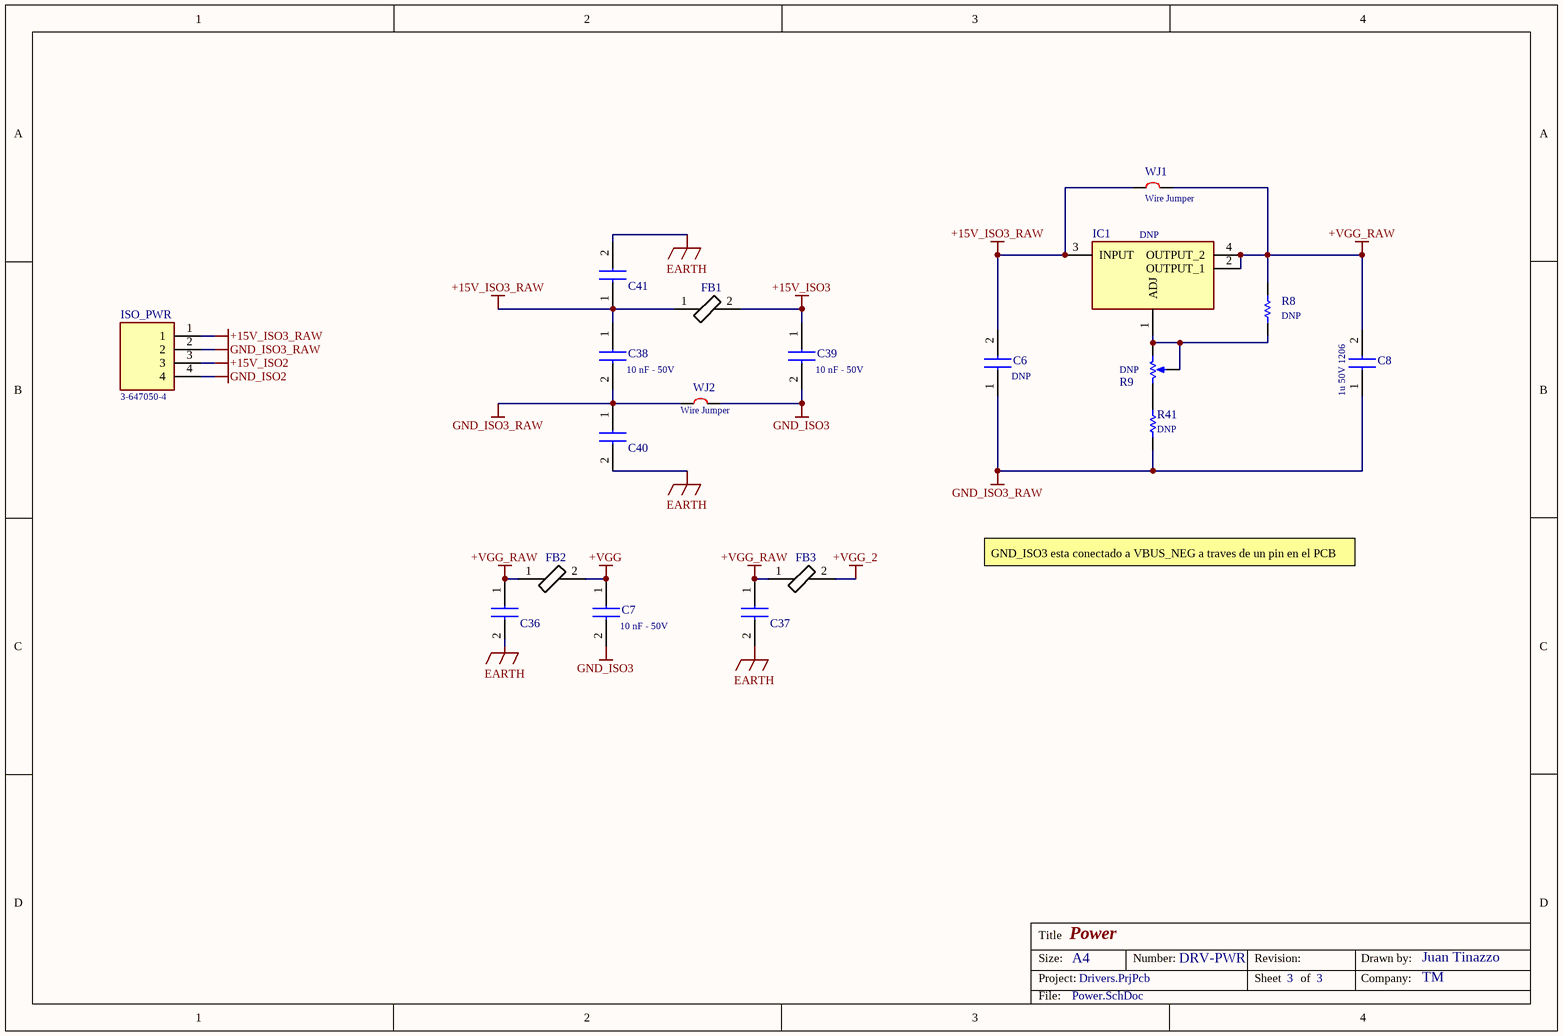
[diagram p2: Power.SchDoc]

### Parts
C6  DNP  [CAPC3216X180N]  (no BOM)
C7  value 10 nF - 50V  [CAPC1608X90N]  (hidden comment: CGA3E2X7R1H103K080AA)
C8  1u 50V 1206  [CAPC3216X180N]
C36  C1206C102KGRACAUTO  [C1206]  (value not drawn)
C37  C1206C102KGRACAUTO  [C1206]  (value not drawn)
C38  value 10 nF - 50V  [CAPC1608X90N]  (hidden comment: CGA3E2X7R1H103K080AA)
C39  value 10 nF - 50V  [CAPC1608X90N]  (hidden comment: CGA3E2X7R1H103K080AA)
C40  C1206C102KGRACAUTO  [C1206]  (value not drawn)
C41  C1206C102KGRACAUTO  [C1206]  (value not drawn)
FB1  78279220601  [BEADC2012X110N]  (value not drawn)
FB2  78279220601  [BEADC2012X110N]  (value not drawn)
FB3  78279220601  [BEADC2012X110N]  (value not drawn)
IC1  DNP  [SOT230P700X180-4N]  (no BOM)
ISO_PWR  3-647050-4  [SHDR4W66P0X254_1X4_1016X635X1079P]
R8  value DNP  [RESC1608X55N]  (hidden comment: CRCW0603220RFKEAC)  (no BOM)
R9  DNP  [3296W-1]  (no BOM)
R41  DNP  [RESC1608X55N]  (no BOM)
WJ1  Wire Jumper  (net tie, no BOM)
WJ2  Wire Jumper  (net tie, no BOM)

### Nets
+15V_ISO2: ISO_PWR.3
+15V_ISO3: C39.1 FB1.2
+15V_ISO3_RAW: C6.2 C38.1 C41.1 FB1.1 IC1.3(INPUT) ISO_PWR.1 WJ1.0
+VGG: C7.1 FB2.2
+VGG_2: FB3.2
+VGG_RAW: C8.2 C36.1 C37.1 FB2.1 FB3.1 IC1.2(OUTPUT_1) IC1.4(OUTPUT_2) R8.1 WJ1.1
EARTH: C36.2 C37.2 C40.2 C41.2
GND_ISO2: ISO_PWR.4
GND_ISO3: C7.2 C39.2 WJ2.1
GND_ISO3_RAW: C6.1 C8.1 C38.2 C40.1 ISO_PWR.2 R41.2 WJ2.0
NetIC1_1: IC1.1(ADJ) R8.2 R9.1(TOP) R9.2(BOT)
NetR9_3: R9.3(TAP) R41.1

### Notes on the sheet
- GND_ISO3 esta conectado a VBUS_NEG a traves de un pin en el PCB
- Title
- Size:
- Project:
- A4
- Number:
- Revision:
- Sheet
- of
- Drawn by:
- Company:
- File:

### Library data of the parts
C6 C8 = C3216X7R1H105K160AE: as C3 on sheet Drivers; Datasheet Link: https://product.tdk.com/info/en/catalog/datasheets/mlcc_commercial_midvoltage_en.pdf; Height: 1.8mm; Manufacturer_Part_Number: C3216X7R1H105K160AE; Mouser Part Number: 810-C3216X7R1H105KST; Mouser Price/Stock: https://www.mouser.co.uk/ProductDetail/TDK/C3216X7R1H105K160AE?qs=LcTL%2F5vFEzHWgMW0Em18fQ%3D%3D; Arrow Part Number: C3216X7R1H105K160AE; Arrow Price/Stock: https://www.arrow.com/en/products/c3216x7r1h105k160ae/tdk?region=nac
C7 C38 C39 = CGA3E2X7R1H103K080AA: Capacitor; Manufacturer_Name: TDK-Lambda; Datasheet Link: http://docs-europe.electrocomponents.com/webdocs/14e9/0900766b814e9125.pdf; Height: 0.9mm; Manufacturer_Part_Number: CGA3E2X7R1H103K080AA; Mouser Part Number: 810-CGA3E2X7R1H103K; Mouser Price/Stock: https://www.mouser.co.uk/ProductDetail/TDK/CGA3E2X7R1H103K080AA?qs=NRhsANhppD8MREuCb2mQKQ%3D%3D; Arrow Part Number: CGA3E2X7R1H103K080AA; Arrow Price/Stock: https://www.arrow.com/en/products/cga3e2x7r1h103k080aa/tdk?region=nac
C36 C37 C40 C41 = C1206C102KGRACAUTO: Capacitor; Manufacturer_Name: KEMET; Value: 1nF - 2000V; Datasheet Link: https://content.kemet.com/datasheets/KEM_C1076_X7R_HV_AUTO_SMD.pdf; Manufacturer_Part_Number: C1206C102KGRACAUTO; Mouser Part Number: 80-C1206C102KGRAUTO; Mouser Price/Stock: https://www.mouser.co.uk/ProductDetail/KEMET/C1206C102KGRACAUTO?qs=02kMkzikyGKenJNcwYLRQw%3D%3D; Arrow Part Number: C1206C102KGRACAUTO; Arrow Price/Stock: https://www.arrow.com/en/products/c1206c102kgracauto/kemet-corporation?region=nac
FB1-FB3 = 78279220601: Ferrite Bead; Manufacturer_Name: Wurth Elektronik; Value: Núcleos de ferrita WE-MPSA EMI 600Ohms 2.1A 80mOhms; Datasheet Link: https://www.mouser.de/datasheet/2/445/78279220601-2298574.pdf; Height: 1.1mm; Manufacturer_Part_Number: 78279220601; Mouser Part Number: 710-78279220601; Mouser Price/Stock: https://www.mouser.co.uk/ProductDetail/Wurth-Elektronik/78279220601?qs=iLbezkQI%252BsjgiK1FovJqGg%3D%3D
IC1 = NCP1117LPSTADT3G: Integrated Circuit; Manufacturer_Name: onsemi; Datasheet Link: http://www.onsemi.com/pub/Collateral/NCP1117LP-D.PDF; Height: 1.8mm; Manufacturer_Part_Number: NCP1117LPSTADT3G; Mouser Part Number: 863-NCP1117LPSTADT3G; Mouser Price/Stock: https://www.mouser.co.uk/ProductDetail/onsemi/NCP1117LPSTADT3G?qs=kbSN2QblFfLHsV%252B%252BQZ5KoA%3D%3D; Arrow Part Number: NCP1117LPSTADT3G; Arrow Price/Stock: https://www.arrow.com/en/products/ncp1117lpstadt3g/on-semiconductor?region=nac; Value: DNP
ISO_PWR = 3-647050-4: Connector; Manufacturer_Name: TE Connectivity; Value: Alojamientos de cables y cabecera HDR 02P VRT; Datasheet Link: https://www.te.com/commerce/DocumentDelivery/DDEController?Action=showdoc&DocId=Customer+Drawing%7F647050%7FU%7Fpdf%7FEnglish%7FENG_CD_647050_U.pdf%7F3-647050-4; Height: 10.79mm; Manufacturer_Part_Number: 3-647050-4; Mouser Part Number: 571-3-647050-4; Mouser Price/Stock: https://www.mouser.co.uk/ProductDetail/TE-Connectivity-AMP/3-647050-4?qs=W5ux9j661SoBsMK9vpa9%252BQ%3D%3D; Arrow Part Number: 3-647050-4; Arrow Price/Stock: https://www.arrow.com/en/products/3-647050-4/te-connectivity?region=nac; System: Connector
R8 = CRCW0603220RFKEAC: Resistor; Manufacturer_Name: Vishay; Datasheet Link: http://www.vishay.com/docs/28773/crcwce3.pdf; Height: 0.55mm; Manufacturer_Part_Number: CRCW0603220RFKEAC; Mouser Part Number: 71-CRCW0603220RFKEAC; Mouser Price/Stock: https://www.mouser.co.uk/ProductDetail/Vishay-Dale/CRCW0603220RFKEAC?qs=E3Y5ESvWgWOUrnKUP8Zt%2Fg%3D%3D; Arrow Part Number: CRCW0603220RFKEAC; Arrow Price/Stock: https://www.arrow.com/en/products/crcw0603220rfkeac/vishay?region=nac
R9 = 3296W-1-502LF: Resistor; Manufacturer_Name: Bourns; Value: 5k - DNP; Datasheet Link: https://componentsearchengine.com/Datasheets/2/3296W-1-502LF.pdf; Manufacturer_Part_Number: 3296W-1-502LF; Mouser Part Number: 652-3296W-1-502LF; Mouser Price/Stock: https://www.mouser.co.uk/ProductDetail/Bourns/3296W-1-502LF?qs=zl1BDXJPZVrTnesl5BcuCQ%3D%3D; Arrow Part Number: 3296W-1-502LF; Arrow Price/Stock: https://www.arrow.com/en/products/3296w-1-502lf/bourns?region=europe
R41 = ERJ-3EKF6800V: Resistor; Manufacturer_Name: Panasonic; Value: 680 Ohm - 1/10 W; Datasheet Link: http://industrial.panasonic.com/cdbs/www-data/pdf/RDA0000/AOA0000C86.pdf; Height: 0.55mm; Manufacturer_Part_Number: ERJ-3EKF6800V; Mouser Part Number: 667-ERJ-3EKF6800V; Mouser Price/Stock: https://www.mouser.co.uk/ProductDetail/Panasonic/ERJ-3EKF6800V?qs=iBwFsHVUAOdujdiQBDzX2w%3D%3D; Arrow Part Number: ERJ-3EKF6800V; Arrow Price/Stock: https://www.arrow.com/en/products/erj-3ekf6800v/panasonic
WJ1 WJ2 = Wire Jumper: Manufacturer_Part_Number: Wire; Value: Jumper

## Nets that join several sheets
+5V: Drivers (17 pins), Gates (12 pins)
+15V_ISO2: Drivers (C3.2 D23.1 U4.5), Power (ISO_PWR.3)
+15V_ISO3: Drivers (22 pins), Power (C39.1 FB1.2)
DGND: Drivers (48 pins), Gates (12 pins)
EARTH: Drivers (J1.1 J1.2 SIGNALS_CB.MH1 SIGNALS_CB.MH2), Power (C36.2 C37.2 C40.2 C41.2)
GND_ISO2: Drivers (7 pins), Power (ISO_PWR.4)
GND_ISO3: Drivers (20 pins), Power (C7.2 C39.2 WJ2.1)
FLT: Drivers (SIGNALS_CB.12), Gates (IC13.4)
FLT_FD: Drivers (U4.13), Gates (IC11.1)
FLT_HS_1: Drivers (U5.5), Gates (IC7.2)
FLT_HS_2: Drivers (U3.5), Gates (IC9.2)
FLT_LS_1: Drivers (U5.15), Gates (IC7.1)
FLT_LS_2: Drivers (U3.15), Gates (IC9.1)
FLT_ZR1: Drivers (U1.13), Gates (IC11.2)
FLT_ZR2: Drivers (U2.13), Gates (IC14.1)
RDY: Drivers (SIGNALS_CB.11), Gates (IC12.4)
RDY_FD: Drivers (U4.12), Gates (IC10.2)
RDY_HS_1: Drivers (U5.4), Gates (IC6.2)
RDY_HS_2: Drivers (U3.4), Gates (IC8.2)
RDY_LS_1: Drivers (U5.14), Gates (IC6.1)
RDY_LS_2: Drivers (U3.14), Gates (IC8.1)
RDY_ZR1: Drivers (U1.12), Gates (IC10.1)
RDY_ZR2: Drivers (U2.12), Gates (IC15.1)